# EasyEDA Pro project SCH.epro

# Schematic Schematic1_1

## Sheets
1 P1: Board Name: Board1_1; Create Date: 2026-05-31; Page Name: P1; Project Name: Clockie+1; Schematic Name: Schematic1_1; Update Date: 2026-05-31; Company: EasyEDA.com; Page Size: A4; Version: V1.0
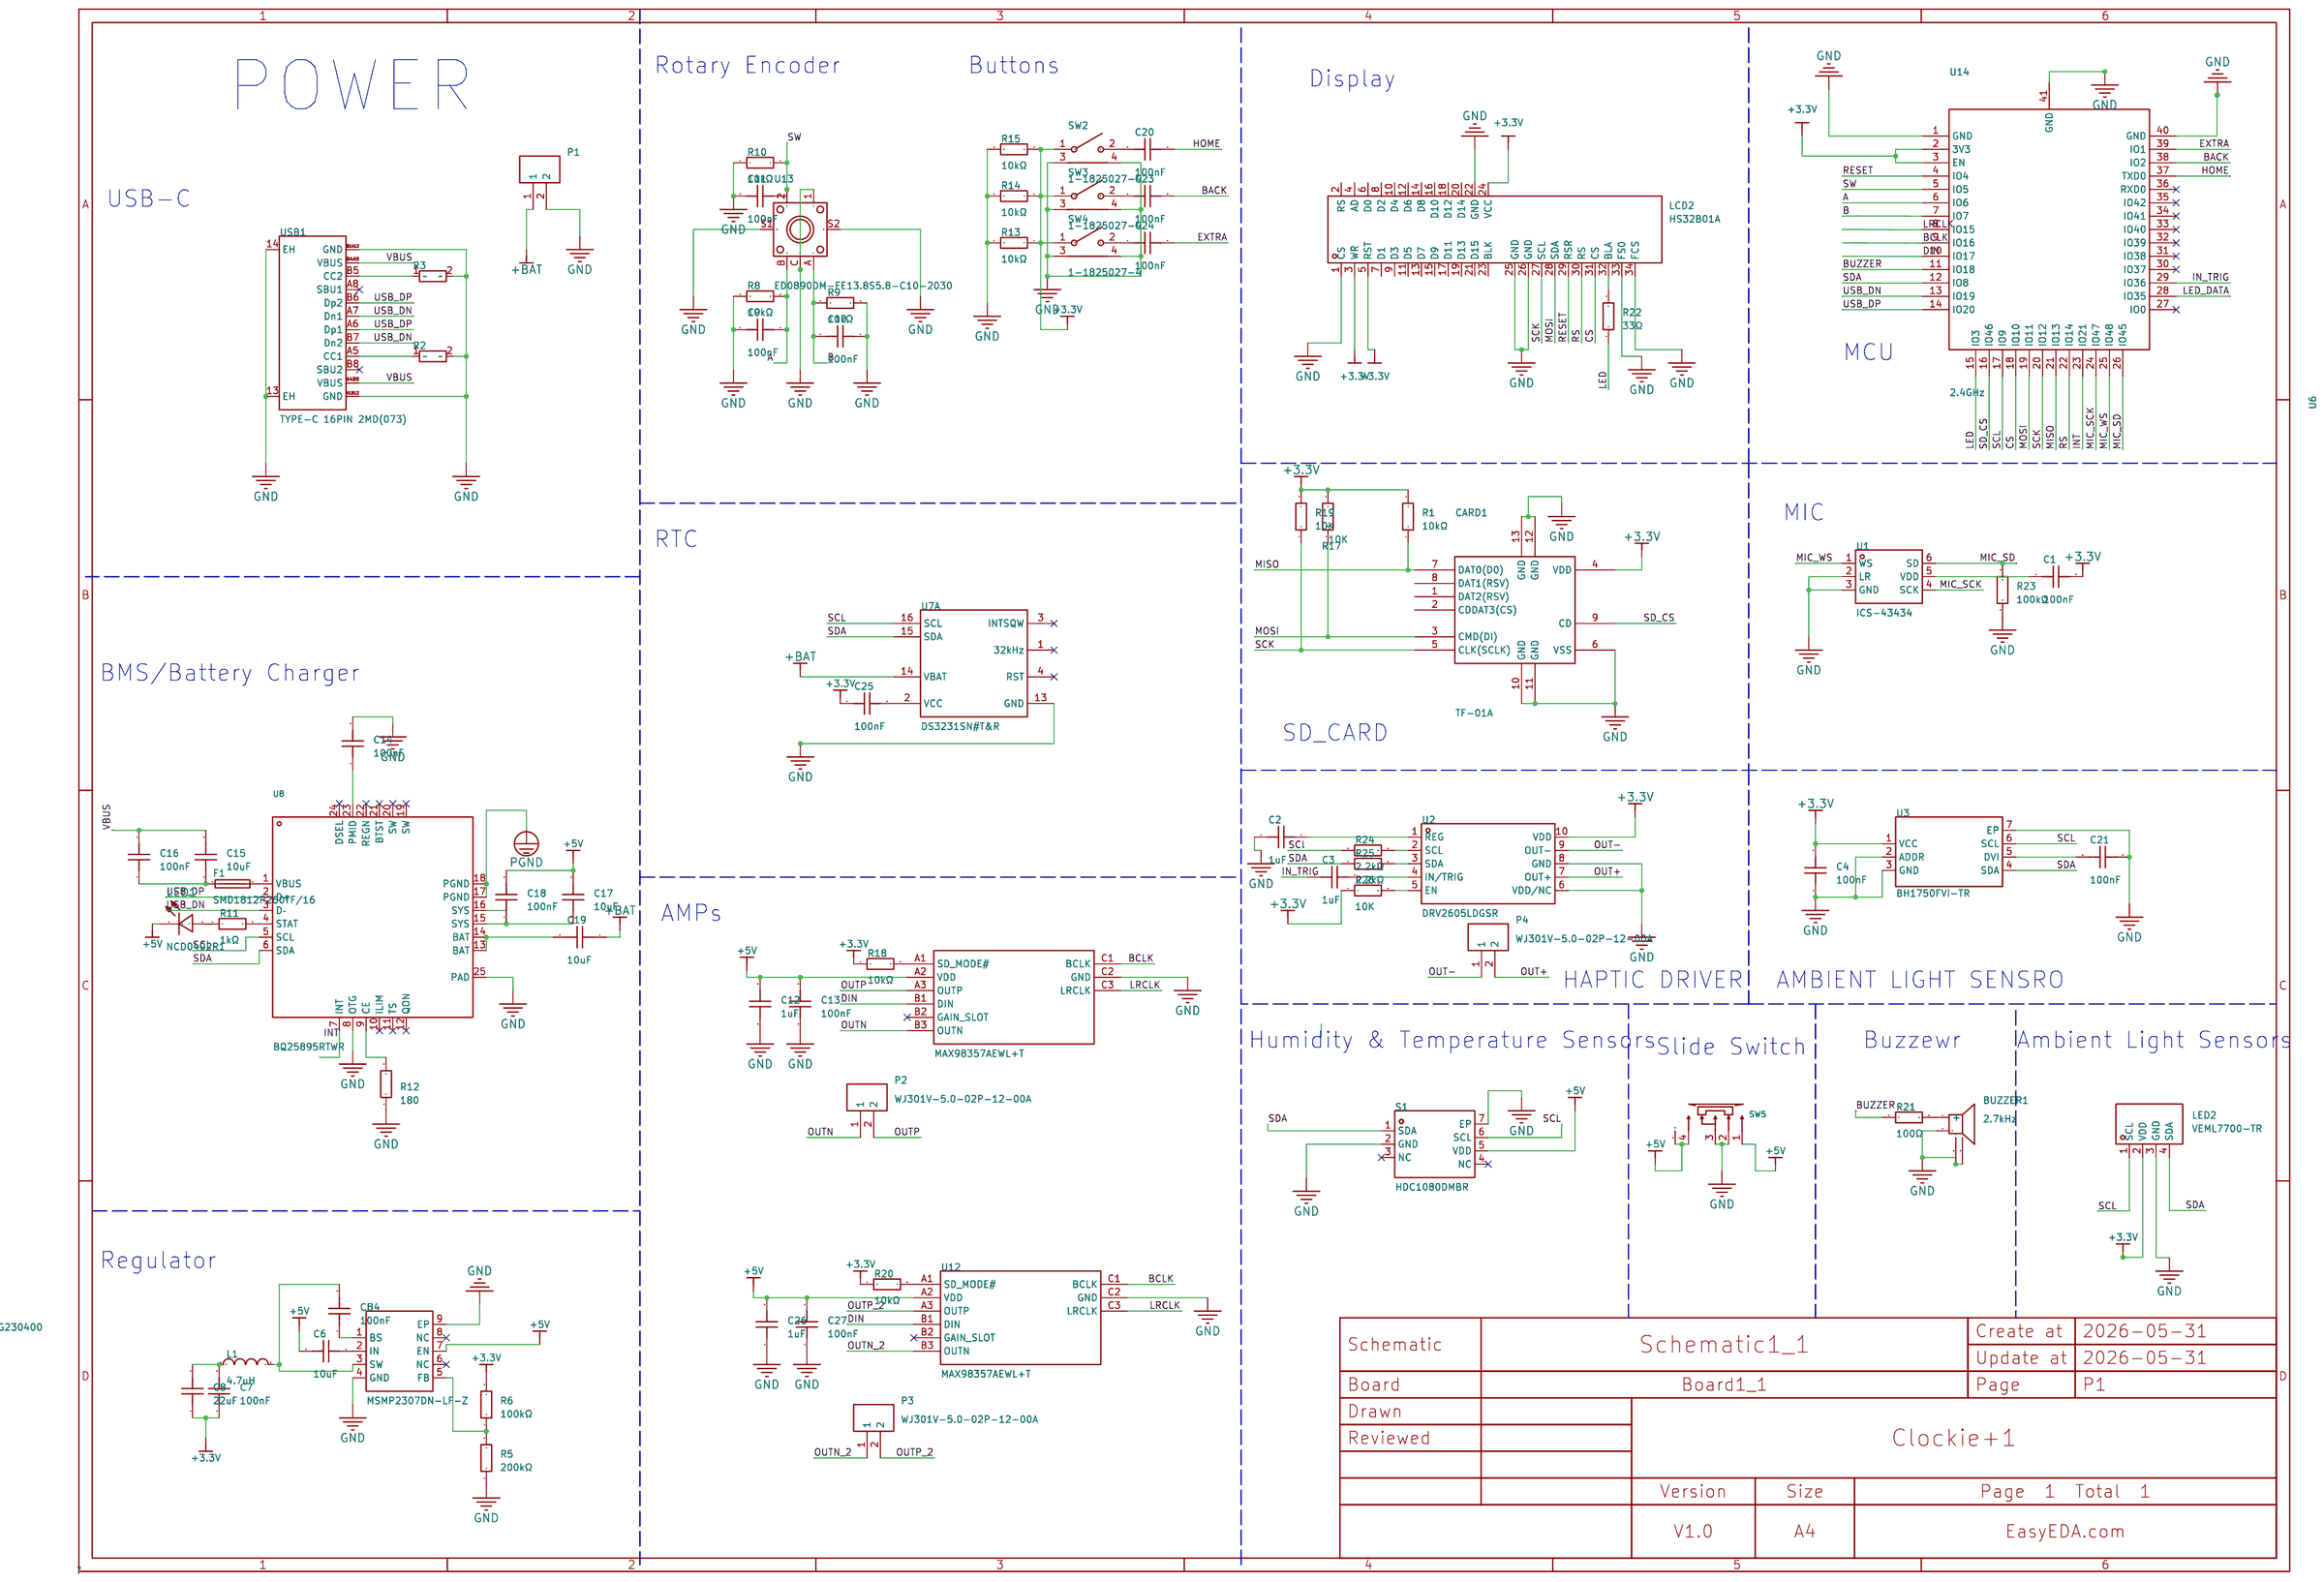
[diagram p0: P1]
2 LED: Create Date: 2026-06-07; Page Name: P2; Update Date: 2026-06-07
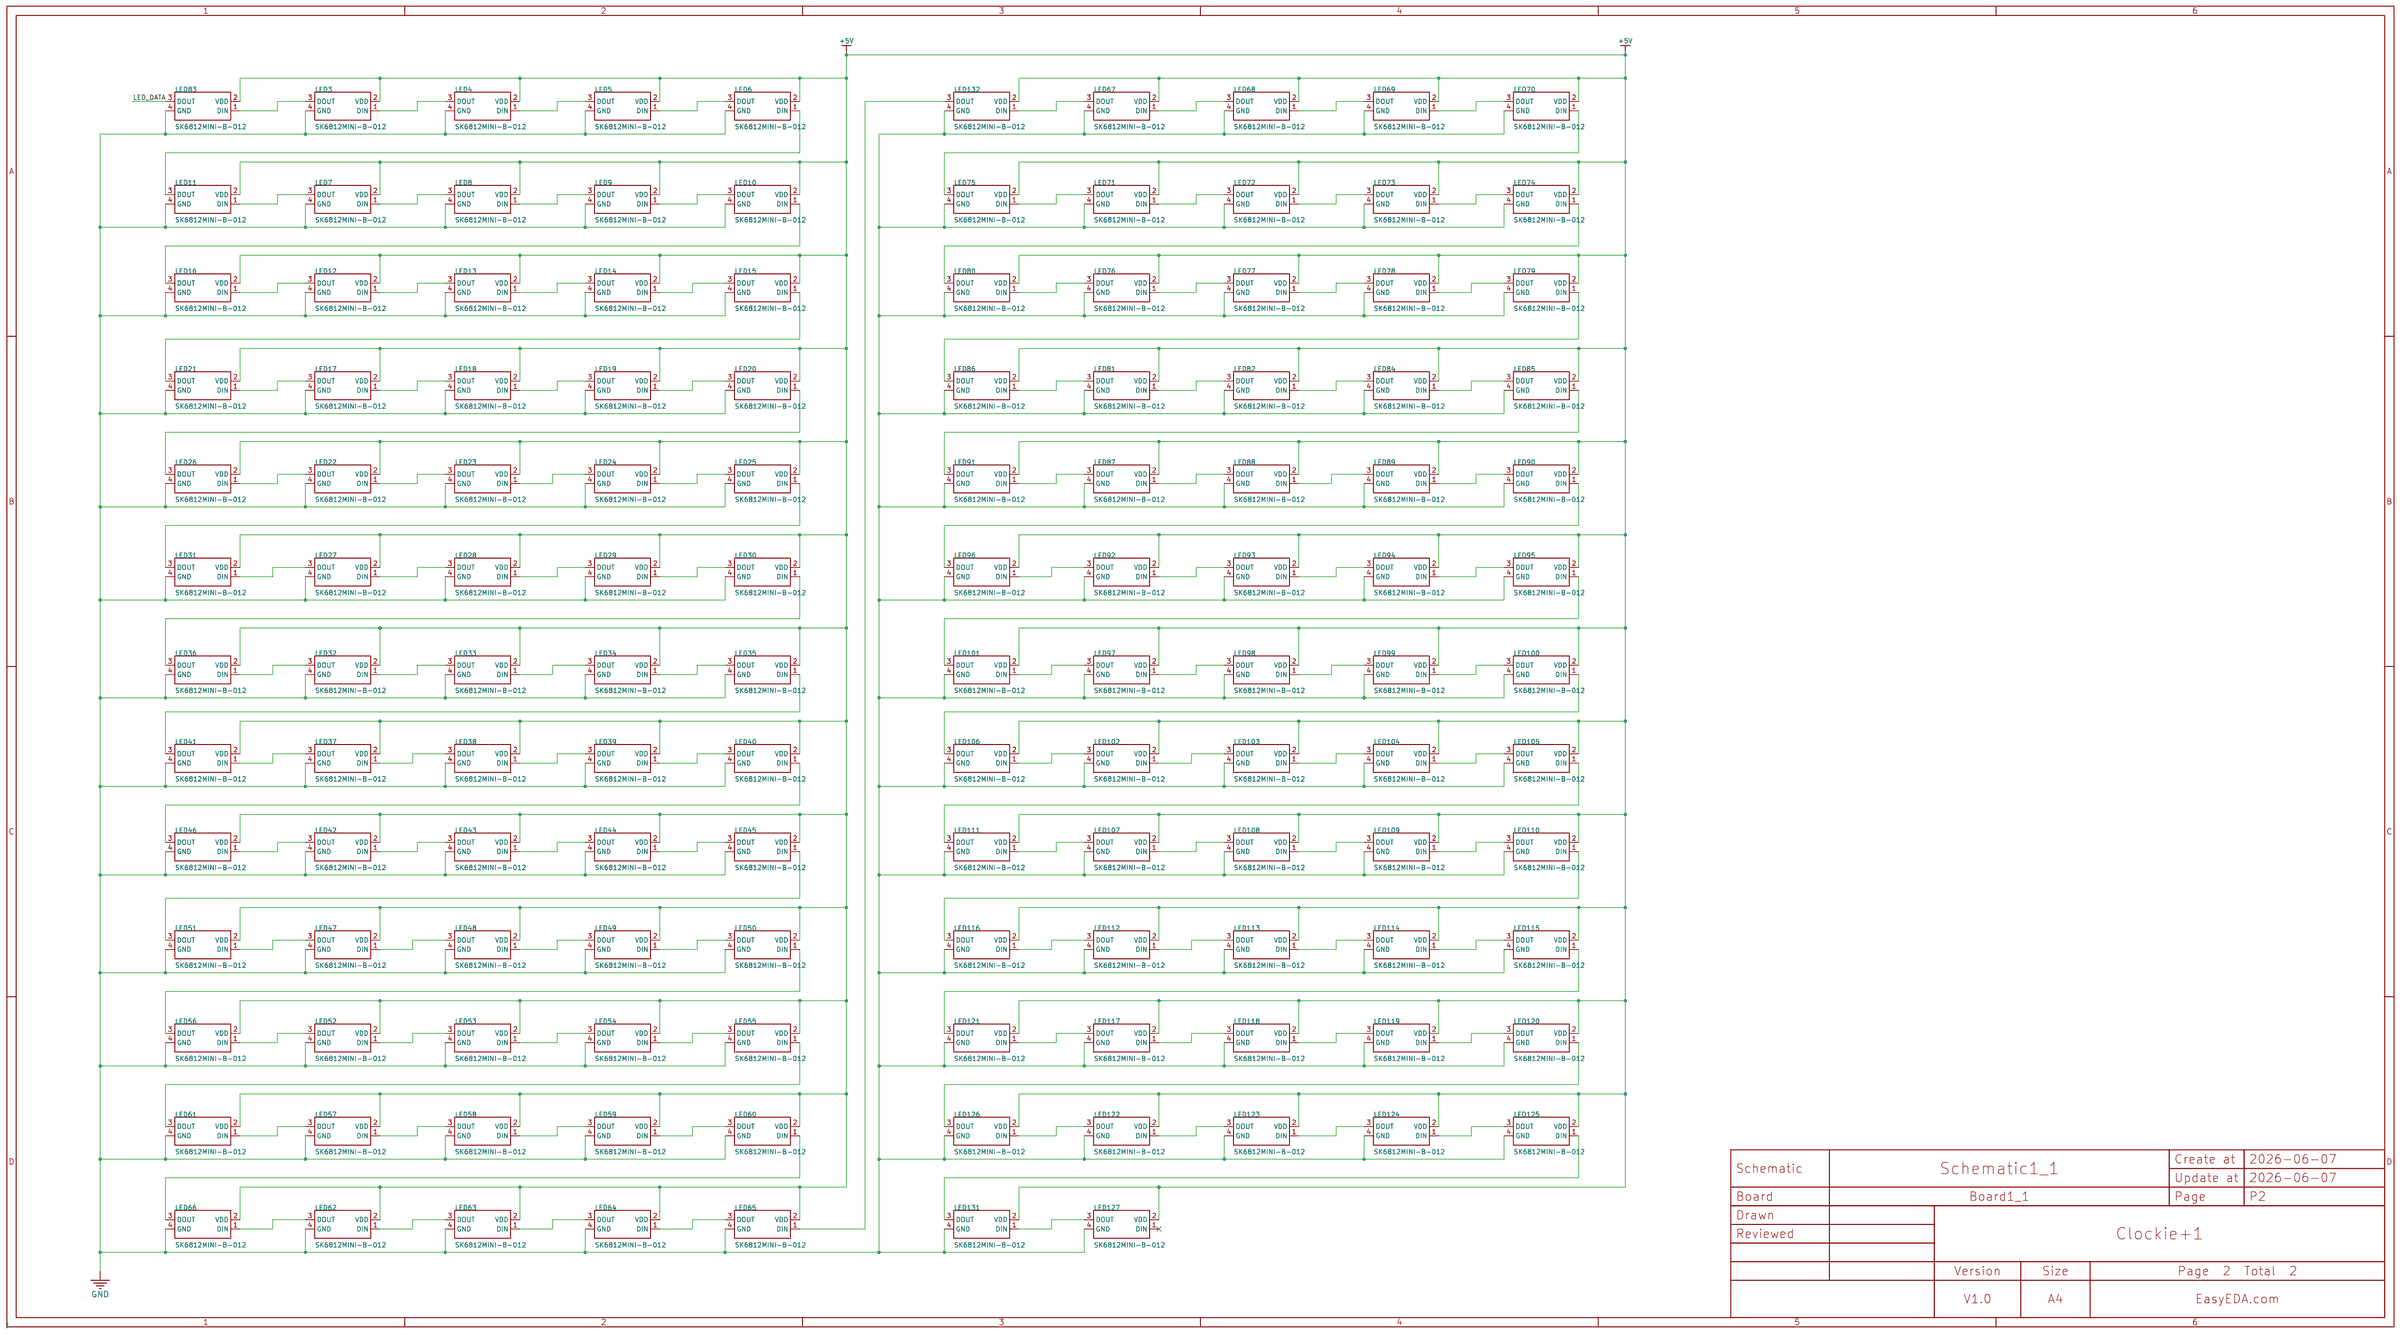
[diagram p1: LED]

## Parts
sheet LED
LED3  SK6812MINI-B-012  [LED-SMD_4P-L3.5-W3.5-R-SK6812MINI]
LED4  SK6812MINI-B-012  [LED-SMD_4P-L3.5-W3.5-R-SK6812MINI]
LED5  SK6812MINI-B-012  [LED-SMD_4P-L3.5-W3.5-R-SK6812MINI]
LED6  SK6812MINI-B-012  [LED-SMD_4P-L3.5-W3.5-R-SK6812MINI]
LED7  SK6812MINI-B-012  [LED-SMD_4P-L3.5-W3.5-R-SK6812MINI]
LED8  SK6812MINI-B-012  [LED-SMD_4P-L3.5-W3.5-R-SK6812MINI]
LED9  SK6812MINI-B-012  [LED-SMD_4P-L3.5-W3.5-R-SK6812MINI]
LED10  SK6812MINI-B-012  [LED-SMD_4P-L3.5-W3.5-R-SK6812MINI]
LED11  SK6812MINI-B-012  [LED-SMD_4P-L3.5-W3.5-R-SK6812MINI]
LED12  SK6812MINI-B-012  [LED-SMD_4P-L3.5-W3.5-R-SK6812MINI]
LED13  SK6812MINI-B-012  [LED-SMD_4P-L3.5-W3.5-R-SK6812MINI]
LED14  SK6812MINI-B-012  [LED-SMD_4P-L3.5-W3.5-R-SK6812MINI]
LED15  SK6812MINI-B-012  [LED-SMD_4P-L3.5-W3.5-R-SK6812MINI]
LED16  SK6812MINI-B-012  [LED-SMD_4P-L3.5-W3.5-R-SK6812MINI]
LED17  SK6812MINI-B-012  [LED-SMD_4P-L3.5-W3.5-R-SK6812MINI]
LED18  SK6812MINI-B-012  [LED-SMD_4P-L3.5-W3.5-R-SK6812MINI]
LED19  SK6812MINI-B-012  [LED-SMD_4P-L3.5-W3.5-R-SK6812MINI]
LED20  SK6812MINI-B-012  [LED-SMD_4P-L3.5-W3.5-R-SK6812MINI]
LED21  SK6812MINI-B-012  [LED-SMD_4P-L3.5-W3.5-R-SK6812MINI]
LED22  SK6812MINI-B-012  [LED-SMD_4P-L3.5-W3.5-R-SK6812MINI]
LED23  SK6812MINI-B-012  [LED-SMD_4P-L3.5-W3.5-R-SK6812MINI]
LED24  SK6812MINI-B-012  [LED-SMD_4P-L3.5-W3.5-R-SK6812MINI]
LED25  SK6812MINI-B-012  [LED-SMD_4P-L3.5-W3.5-R-SK6812MINI]
LED26  SK6812MINI-B-012  [LED-SMD_4P-L3.5-W3.5-R-SK6812MINI]
LED27  SK6812MINI-B-012  [LED-SMD_4P-L3.5-W3.5-R-SK6812MINI]
LED28  SK6812MINI-B-012  [LED-SMD_4P-L3.5-W3.5-R-SK6812MINI]
LED29  SK6812MINI-B-012  [LED-SMD_4P-L3.5-W3.5-R-SK6812MINI]
LED30  SK6812MINI-B-012  [LED-SMD_4P-L3.5-W3.5-R-SK6812MINI]
LED31  SK6812MINI-B-012  [LED-SMD_4P-L3.5-W3.5-R-SK6812MINI]
LED32  SK6812MINI-B-012  [LED-SMD_4P-L3.5-W3.5-R-SK6812MINI]
LED33  SK6812MINI-B-012  [LED-SMD_4P-L3.5-W3.5-R-SK6812MINI]
LED34  SK6812MINI-B-012  [LED-SMD_4P-L3.5-W3.5-R-SK6812MINI]
LED35  SK6812MINI-B-012  [LED-SMD_4P-L3.5-W3.5-R-SK6812MINI]
LED36  SK6812MINI-B-012  [LED-SMD_4P-L3.5-W3.5-R-SK6812MINI]
LED37  SK6812MINI-B-012  [LED-SMD_4P-L3.5-W3.5-R-SK6812MINI]
LED38  SK6812MINI-B-012  [LED-SMD_4P-L3.5-W3.5-R-SK6812MINI]
LED39  SK6812MINI-B-012  [LED-SMD_4P-L3.5-W3.5-R-SK6812MINI]
LED40  SK6812MINI-B-012  [LED-SMD_4P-L3.5-W3.5-R-SK6812MINI]
LED41  SK6812MINI-B-012  [LED-SMD_4P-L3.5-W3.5-R-SK6812MINI]
LED42  SK6812MINI-B-012  [LED-SMD_4P-L3.5-W3.5-R-SK6812MINI]
LED43  SK6812MINI-B-012  [LED-SMD_4P-L3.5-W3.5-R-SK6812MINI]
LED44  SK6812MINI-B-012  [LED-SMD_4P-L3.5-W3.5-R-SK6812MINI]
LED45  SK6812MINI-B-012  [LED-SMD_4P-L3.5-W3.5-R-SK6812MINI]
LED46  SK6812MINI-B-012  [LED-SMD_4P-L3.5-W3.5-R-SK6812MINI]
LED47  SK6812MINI-B-012  [LED-SMD_4P-L3.5-W3.5-R-SK6812MINI]
LED48  SK6812MINI-B-012  [LED-SMD_4P-L3.5-W3.5-R-SK6812MINI]
LED49  SK6812MINI-B-012  [LED-SMD_4P-L3.5-W3.5-R-SK6812MINI]
LED50  SK6812MINI-B-012  [LED-SMD_4P-L3.5-W3.5-R-SK6812MINI]
LED51  SK6812MINI-B-012  [LED-SMD_4P-L3.5-W3.5-R-SK6812MINI]
LED52  SK6812MINI-B-012  [LED-SMD_4P-L3.5-W3.5-R-SK6812MINI]
LED53  SK6812MINI-B-012  [LED-SMD_4P-L3.5-W3.5-R-SK6812MINI]
LED54  SK6812MINI-B-012  [LED-SMD_4P-L3.5-W3.5-R-SK6812MINI]
LED55  SK6812MINI-B-012  [LED-SMD_4P-L3.5-W3.5-R-SK6812MINI]
LED56  SK6812MINI-B-012  [LED-SMD_4P-L3.5-W3.5-R-SK6812MINI]
LED57  SK6812MINI-B-012  [LED-SMD_4P-L3.5-W3.5-R-SK6812MINI]
LED58  SK6812MINI-B-012  [LED-SMD_4P-L3.5-W3.5-R-SK6812MINI]
LED59  SK6812MINI-B-012  [LED-SMD_4P-L3.5-W3.5-R-SK6812MINI]
LED60  SK6812MINI-B-012  [LED-SMD_4P-L3.5-W3.5-R-SK6812MINI]
LED61  SK6812MINI-B-012  [LED-SMD_4P-L3.5-W3.5-R-SK6812MINI]
LED62  SK6812MINI-B-012  [LED-SMD_4P-L3.5-W3.5-R-SK6812MINI]
LED63  SK6812MINI-B-012  [LED-SMD_4P-L3.5-W3.5-R-SK6812MINI]
LED64  SK6812MINI-B-012  [LED-SMD_4P-L3.5-W3.5-R-SK6812MINI]
LED65  SK6812MINI-B-012  [LED-SMD_4P-L3.5-W3.5-R-SK6812MINI]
LED66  SK6812MINI-B-012  [LED-SMD_4P-L3.5-W3.5-R-SK6812MINI]
LED67  SK6812MINI-B-012  [LED-SMD_4P-L3.5-W3.5-R-SK6812MINI]
LED68  SK6812MINI-B-012  [LED-SMD_4P-L3.5-W3.5-R-SK6812MINI]
LED69  SK6812MINI-B-012  [LED-SMD_4P-L3.5-W3.5-R-SK6812MINI]
LED70  SK6812MINI-B-012  [LED-SMD_4P-L3.5-W3.5-R-SK6812MINI]
LED71  SK6812MINI-B-012  [LED-SMD_4P-L3.5-W3.5-R-SK6812MINI]
LED72  SK6812MINI-B-012  [LED-SMD_4P-L3.5-W3.5-R-SK6812MINI]
LED73  SK6812MINI-B-012  [LED-SMD_4P-L3.5-W3.5-R-SK6812MINI]
LED74  SK6812MINI-B-012  [LED-SMD_4P-L3.5-W3.5-R-SK6812MINI]
LED75  SK6812MINI-B-012  [LED-SMD_4P-L3.5-W3.5-R-SK6812MINI]
LED76  SK6812MINI-B-012  [LED-SMD_4P-L3.5-W3.5-R-SK6812MINI]
LED77  SK6812MINI-B-012  [LED-SMD_4P-L3.5-W3.5-R-SK6812MINI]
LED78  SK6812MINI-B-012  [LED-SMD_4P-L3.5-W3.5-R-SK6812MINI]
LED79  SK6812MINI-B-012  [LED-SMD_4P-L3.5-W3.5-R-SK6812MINI]
LED80  SK6812MINI-B-012  [LED-SMD_4P-L3.5-W3.5-R-SK6812MINI]
LED81  SK6812MINI-B-012  [LED-SMD_4P-L3.5-W3.5-R-SK6812MINI]
LED82  SK6812MINI-B-012  [LED-SMD_4P-L3.5-W3.5-R-SK6812MINI]
LED83  SK6812MINI-B-012  [LED-SMD_4P-L3.5-W3.5-R-SK6812MINI]
LED84  SK6812MINI-B-012  [LED-SMD_4P-L3.5-W3.5-R-SK6812MINI]
LED85  SK6812MINI-B-012  [LED-SMD_4P-L3.5-W3.5-R-SK6812MINI]
LED86  SK6812MINI-B-012  [LED-SMD_4P-L3.5-W3.5-R-SK6812MINI]
LED87  SK6812MINI-B-012  [LED-SMD_4P-L3.5-W3.5-R-SK6812MINI]
LED88  SK6812MINI-B-012  [LED-SMD_4P-L3.5-W3.5-R-SK6812MINI]
LED89  SK6812MINI-B-012  [LED-SMD_4P-L3.5-W3.5-R-SK6812MINI]
LED90  SK6812MINI-B-012  [LED-SMD_4P-L3.5-W3.5-R-SK6812MINI]
LED91  SK6812MINI-B-012  [LED-SMD_4P-L3.5-W3.5-R-SK6812MINI]
LED92  SK6812MINI-B-012  [LED-SMD_4P-L3.5-W3.5-R-SK6812MINI]
LED93  SK6812MINI-B-012  [LED-SMD_4P-L3.5-W3.5-R-SK6812MINI]
LED94  SK6812MINI-B-012  [LED-SMD_4P-L3.5-W3.5-R-SK6812MINI]
LED95  SK6812MINI-B-012  [LED-SMD_4P-L3.5-W3.5-R-SK6812MINI]
LED96  SK6812MINI-B-012  [LED-SMD_4P-L3.5-W3.5-R-SK6812MINI]
LED97  SK6812MINI-B-012  [LED-SMD_4P-L3.5-W3.5-R-SK6812MINI]
LED98  SK6812MINI-B-012  [LED-SMD_4P-L3.5-W3.5-R-SK6812MINI]
LED99  SK6812MINI-B-012  [LED-SMD_4P-L3.5-W3.5-R-SK6812MINI]
LED100  SK6812MINI-B-012  [LED-SMD_4P-L3.5-W3.5-R-SK6812MINI]
LED101  SK6812MINI-B-012  [LED-SMD_4P-L3.5-W3.5-R-SK6812MINI]
LED102  SK6812MINI-B-012  [LED-SMD_4P-L3.5-W3.5-R-SK6812MINI]
LED103  SK6812MINI-B-012  [LED-SMD_4P-L3.5-W3.5-R-SK6812MINI]
LED104  SK6812MINI-B-012  [LED-SMD_4P-L3.5-W3.5-R-SK6812MINI]
LED105  SK6812MINI-B-012  [LED-SMD_4P-L3.5-W3.5-R-SK6812MINI]
LED106  SK6812MINI-B-012  [LED-SMD_4P-L3.5-W3.5-R-SK6812MINI]
LED107  SK6812MINI-B-012  [LED-SMD_4P-L3.5-W3.5-R-SK6812MINI]
LED108  SK6812MINI-B-012  [LED-SMD_4P-L3.5-W3.5-R-SK6812MINI]
LED109  SK6812MINI-B-012  [LED-SMD_4P-L3.5-W3.5-R-SK6812MINI]
LED110  SK6812MINI-B-012  [LED-SMD_4P-L3.5-W3.5-R-SK6812MINI]
LED111  SK6812MINI-B-012  [LED-SMD_4P-L3.5-W3.5-R-SK6812MINI]
LED112  SK6812MINI-B-012  [LED-SMD_4P-L3.5-W3.5-R-SK6812MINI]
LED113  SK6812MINI-B-012  [LED-SMD_4P-L3.5-W3.5-R-SK6812MINI]
LED114  SK6812MINI-B-012  [LED-SMD_4P-L3.5-W3.5-R-SK6812MINI]
LED115  SK6812MINI-B-012  [LED-SMD_4P-L3.5-W3.5-R-SK6812MINI]
LED116  SK6812MINI-B-012  [LED-SMD_4P-L3.5-W3.5-R-SK6812MINI]
LED117  SK6812MINI-B-012  [LED-SMD_4P-L3.5-W3.5-R-SK6812MINI]
LED118  SK6812MINI-B-012  [LED-SMD_4P-L3.5-W3.5-R-SK6812MINI]
LED119  SK6812MINI-B-012  [LED-SMD_4P-L3.5-W3.5-R-SK6812MINI]
LED120  SK6812MINI-B-012  [LED-SMD_4P-L3.5-W3.5-R-SK6812MINI]
LED121  SK6812MINI-B-012  [LED-SMD_4P-L3.5-W3.5-R-SK6812MINI]
LED122  SK6812MINI-B-012  [LED-SMD_4P-L3.5-W3.5-R-SK6812MINI]
LED123  SK6812MINI-B-012  [LED-SMD_4P-L3.5-W3.5-R-SK6812MINI]
LED124  SK6812MINI-B-012  [LED-SMD_4P-L3.5-W3.5-R-SK6812MINI]
LED125  SK6812MINI-B-012  [LED-SMD_4P-L3.5-W3.5-R-SK6812MINI]
LED126  SK6812MINI-B-012  [LED-SMD_4P-L3.5-W3.5-R-SK6812MINI]
LED127  SK6812MINI-B-012  [LED-SMD_4P-L3.5-W3.5-R-SK6812MINI]
LED131  SK6812MINI-B-012  [LED-SMD_4P-L3.5-W3.5-R-SK6812MINI]
LED132  SK6812MINI-B-012  [LED-SMD_4P-L3.5-W3.5-R-SK6812MINI]
sheet P1
BUZZER1  2.7kHz  [BUZ-SMD_4P-L8.5-W8.5-P8.50-BR]
C1  100nF  [C0603]
C2  1uF  [C0603]
C3  1uF  [C0603]
C4  100nF  [C0603]
C5  100nF  [C0603]
C6  10uF  [C0603]
C7  100nF  [C0603]
C8  22uF  [C0603]
C9  100nF  [C0603]
C10  100nF  [C0603]
C11  100nF  [C0603]
C12  1uF  [C0603]
C13  100nF  [C0603]
C14  100nF  [C0603]
C15  10uF  [C0603]
C16  100nF  [C0603]
C17  10uF  [C0603]
C18  100nF  [C0603]
C19  10uF  [C0603]
C20  100nF  [C0603]
C21  100nF  [C0603]
C23  100nF  [C0603]
C24  100nF  [C0603]
C25  100nF  [C0603]
C26  1uF  [C0603]
C27  100nF  [C0603]
CARD1  TF-01A  [TF-SMD_TF-01A]
F1  SMD1812P260TF/16  [F1812]
L1  4.7uH  [IND-SMD_L5.0-W5.0]
LCD2  HS32B01A  [LCD-TH_L89.4-W56.0_HS32B01A]
LED1  NCD0402R1  [LED-SMD_L1.0-W0.5_FC-F1005UGK]
LED2  VEML7700-TR  [LED-SMD_4P-L6.8-W2.4_VEML7700-TR]
P1  WJ301V-5.0-02P-12-00A  [CONN-TH_2P-P5.00_WJ301V-5.00-2P]
P2  WJ301V-5.0-02P-12-00A  [CONN-TH_2P-P5.00_WJ301V-5.00-2P]
P3  WJ301V-5.0-02P-12-00A  [CONN-TH_2P-P5.00_WJ301V-5.00-2P]
P4  WJ301V-5.0-02P-12-00A  [CONN-TH_2P-P5.00_WJ301V-5.00-2P]
R1  10kΩ  [R0603]
R2  5.1kΩ  [R0603]
R3  5.1kΩ  [R0603]
R5  200kΩ  [R0603]
R6  100kΩ  [R0603]
R8  10kΩ  [R0603]
R9  10kΩ  [R0603]
R10  10kΩ  [R0603]
R11  1kΩ  [R0603]
R12  180  [R0603]
R13  10kΩ  [R0603]
R14  10kΩ  [R0603]
R15  10kΩ  [R0603]
R17  10K  [R0603]
R18  10kΩ  [R0603]
R19  10K  [R0603]
R20  10kΩ  [R0603]
R21  100Ω  [R1206]
R22  33Ω  [R0402]
R23  100kΩ  [R0603]
R24  2.2kΩ  [R0603]
R25  2.2kΩ  [R0603]
R26  10K  [R0603]
S1  HDC1080DMBR  [SENSOR-SMD_HDC1080DMBR]
SW2  1-1825027-4  [SW-TH_1-1825027-4]
SW3  1-1825027-4  [SW-TH_1-1825027-4]
SW4  1-1825027-4  [SW-TH_1-1825027-4]
SW5  SSAG230400  [SW-SMD_SSAG230400]
U1  ICS-43434  [MIC-SMD_6P-L3.5-W2.7-P0.90-BL]
U2  DRV2605LDGSR  [VSSOP-10_L3.0-W3.0-P0.50-LS4.9-BL]
U3  BH1750FVI-TR  [WSOF-6_L2.6-W1.6-P0.50-TL-EP]
U4  MSMP2307DN-LF-Z  [ESOP-8_L4.9-W3.9-P1.27-LS6.0-BL-EP]
U6  MAX98357AEWL+T  [WLP-9_L1.4-W1.3-P0.40-R3-C3-BR]
U7  DS3231SN#T&R  [SOIC-16_L10.3-W7.5-P1.27-LS10.3-BL]  (section 1)
U8  BQ25895RTWR  [QFN-24_L4.0-W4.0-P0.50-TL-EP2.7]
U12  MAX98357AEWL+T  [WLP-9_L1.4-W1.3-P0.40-R3-C3-BR]
U13  ED0890DM-FE13.8S5.8-C10-2030  [SW-TH_CTR_ED0890DM-FE13.8S5.8-C10-2030]
U14  2.4GHz  [WIRELM-SMD_ESP32-S3-WROOM-1U]
USB1  TYPE-C 16PIN 2MD(073)  [USB-C-SMD_TYPE-C-16PIN-2MD-073]

## Library data of the parts
LED3-LED127 LED131 LED132 = SK6812MINI-B-012: Wavelength:R:620nm~625nm；B:460nm~470nm；G:520nm~530nm Luminous Intensity:B:160mcd~320mcd；G:815mcd~1275mcd；R:240mcd~450mcd Fixed-Frequency Pwm Mode:1kHz Data Transmission Rate:800Kbit/s Voltage - Supply:4.5V~5.5V Voltage - Supply:4.5V~5.5V Quiescent Current; LCSC Part Name: 智能外控表面贴装SMD型LED; Supplier Part: C5183448; Manufacturer: 欧思科光电; Supplier Footprint: SMD3535-4P; JLCPCB Part Class: Extended Part; Datasheet: https://item.szlcsc.com/datasheet/SK6812MINI-B-012/5846109.html; Supplier: LCSC; Wavelength: R:620nm~625nm；B:460nm~470nm；G:520nm~530nm; Luminous Intensity: B:160mcd~320mcd；G:815mcd~1275mcd；R:240mcd~450mcd; Fixed-Frequency Pwm Mode: 1kHz; Data Transmission Rate: 800Kbit/s; Voltage - Supply: 4.5V~5.5V; Quiescent Current: 0.5mA; ESD Withstand Voltage: 2000V; Operating Temperature: -40℃~+85℃; Viewing Angle: 120°; Length: 3.5mm; Width: 1.1mm; Height: 3.7mm; Features: Built-in power-on reset circuit；Built-in power-on reset circuit
BUZZER1 = MLT-8530: Driver Circuitry:Passive (Externally Driven) Technology:Electromagnetic Voltage Rating:3.6V Voltage - Supply:2.5V~4.5V Voltage - Supply:2.5V~4.5V Frequency:2.7kHz Current Consumption:95mA Sound Pressure Level(SPL):80dB Length:8.5mm Width:8.5mm Height:3.3m; LCSC Part Name: 无源(外部驱动) 电磁式 2.7kHz; Supplier Part: C94599; Manufacturer: 华能; Supplier Footprint: SMD,8.5x8.5mm; JLCPCB Part Class: Extended Part; Datasheet: https://item.szlcsc.com/datasheet/MLT-8530/95797.html; Supplier: LCSC; Driver Circuitry: Passive (Externally Driven); Technology: Electromagnetic; Voltage Rating: 3.6V; Voltage - Supply: 2.5V~4.5V; Current Consumption: 95mA; Sound Pressure Level(SPL): 80dB; Length: 8.5mm; Width: 8.5mm; Height: 3.3mm; Operating Temperature: -20℃~+70℃; Mounting Type: SMD
C1 C4 C5 C7 C9-C11 C13 C14 C16 C18 C20 C21 C23-C25 C27 = CC0603KRX7R9BB104: Capacitance:100nF Tolerance:±10% Tolerance:±10% Voltage Rating:50V Temperature Coefficient:X7R; LCSC Part Name: 100nF ±10% 50V; Supplier Part: C14663; Manufacturer: YAGEO(国巨); Supplier Footprint: 0603; JLCPCB Part Class: Basic Part; Datasheet: https://item.szlcsc.com/datasheet/CC0603KRX7R9BB104/15331.html; Supplier: LCSC; Tolerance: ±10%; Voltage Rating: 50V; Temperature Coefficient: X7R
C2 C3 C12 C26 = CL10A105KB8NNNC: Capacitance:1uF Tolerance:±10% Tolerance:±10% Voltage Rating:50V Temperature Coefficient:X5R; LCSC Part Name: 1uF ±10% 50V; Supplier Part: C15849; Manufacturer: SAMSUNG(三星); Supplier Footprint: 0603; JLCPCB Part Class: Basic Part; Datasheet: https://item.szlcsc.com/datasheet/CL10A105KB8NNNC/16531.html; Supplier: LCSC; Tolerance: ±10%; Voltage Rating: 50V; Temperature Coefficient: X5R
C6 C15 C17 C19 = CL10A106MA8NRNC: Capacitance:10uF Tolerance:±20% Tolerance:±20% Voltage Rating:25V Temperature Coefficient:X5R; LCSC Part Name: 10uF ±20% 25V; Supplier Part: C96446; Manufacturer: SAMSUNG(三星); Supplier Footprint: 0603; JLCPCB Part Class: Basic Part; Datasheet: https://item.szlcsc.com/datasheet/CL10A106MA8NRNC/97651.html; Supplier: LCSC; Tolerance: ±20%; Voltage Rating: 25V; Temperature Coefficient: X5R
C8 = CL10A226MP8NUNE: Capacitance:22uF Tolerance:±20% Tolerance:±20% Voltage Rating:10V Temperature Coefficient:X5R; LCSC Part Name: 22uF ±20% 10V; Supplier Part: C86295; Manufacturer: SAMSUNG(三星); Supplier Footprint: 0603; JLCPCB Part Class: Extended Part; Datasheet: https://item.szlcsc.com/datasheet/CL10A226MP8NUNE/87471.html; Supplier: LCSC; Tolerance: ±20%; Voltage Rating: 10V; Temperature Coefficient: X5R
CARD1 = TF-01A_C91145: Card Connection Mode:Push-Push Card Type:MicroSD Card (TF Card) Connector Type:Connector and Ejector Additional Card Detection Pins:- Supplementary Features:With Locating Post Height Above Board:1.85mm Operating Temperature:- Operating Temperature:-; LCSC Part Name: 自弹式 MicroSD卡(TF卡) 卡座; Supplier Part: C91145; Manufacturer: 韩国韩荣; Supplier Footprint: SMD; JLCPCB Part Class: Extended Part; Datasheet: https://item.szlcsc.com/datasheet/TF-01A/92334.html; Supplier: LCSC; Card Connection Mode: Push-Push; Card Type: MicroSD Card (TF Card); Connector Type: Connector and Ejector; Supplementary Features: With Locating Post; Height Above Board: 1.85mm
F1 = SMD1812P260TF/16_C438899: Voltage - Max:16V Current - Max:100A Hold Current:2.6A Trip Current:5A Power Dissipation:1.2W Resistance - Initial (Ri) (Min):15mΩ Resistance - Post Trip (R1) (Max):50mΩ Time to Trip(Max):5s Operating Temperature:-40℃~+85℃ Operating Temperature:-40℃~+85℃; LCSC Part Name: 16V 2.6A 1812自恢复; Supplier Part: C438899; Manufacturer: PTTC(聚鼎); Supplier Footprint: 1812; JLCPCB Part Class: Extended Part; Datasheet: https://item.szlcsc.com/datasheet/SMD1812P260TF%252F16/437537.html; Supplier: LCSC; Voltage - Max: 16V; Current - Max: 100A; Hold Current: 2.6A; Trip Current: 5A; Power Dissipation: 1.2W; Resistance - Initial (Ri) (Min): 15mΩ; Resistance - Post Trip (R1) (Max): 50mΩ; Time to Trip(Max): 5s; Operating Temperature: -40℃~+85℃; Length: 4.9mm; Width: 3.5mm; Height: 2mm
L1 = CKCS5040-4.7uH/M: Inductance:4.7uH Tolerance:±20% Tolerance:±20% Current Rating:3A Current - Saturation(Isat):3.5A DC Resistance(DCR):32mΩ Type:Magnetic Shielded Inductor; LCSC Part Name: 4.7uH ±20%; Supplier Part: C354606; Manufacturer: CENKER(岑科); Supplier Footprint: SMD,5x5mm; JLCPCB Part Class: Extended Part; Datasheet: https://item.szlcsc.com/datasheet/CKCS5040-4.7uH%252FM/330231.html; Supplier: LCSC; Tolerance: ±20%; Current Rating: 3A; Current - Saturation(Isat): 3.5A; DC Resistance(DCR): 32mΩ; Type: Magnetic Shielded Inductor
LCD2 = HS32B01A: Controller Type:ST7789 Interface:SPI Size:3.2 Dot Pixels:320x240 Operating Temperature:-20℃~+70℃ Operating Temperature:-20℃~+70℃ Display Range:49.4x65.5mm Viewing Direction:12 o'clock Voltage - Supply:2.7V~3.3V Voltage - Supply:2.7V~3.3V; LCSC Part Name: 3.2’TFT 240*320(RGB); Supplier Part: C19632786; Manufacturer: HS(汉昇); JLCPCB Part Class: Extended Part; Datasheet: https://item.szlcsc.com/datasheet/HS32B01A/20932984.html; Supplier: LCSC; Controller Type: ST7789; Interface: SPI; Size: 3.2; Dot Pixels: 320x240; Operating Temperature: -20℃~+70℃; Display Range: 49.4x65.5mm; Viewing Direction: 12 o'clock; Voltage - Supply: 2.7V~3.3V
LED1 = NCD0402R1: Lamp Holder Type:- Illumination Color:Red Voltage - Forward(Vf):1.6V~2.6V Voltage - Forward(Vf):1.6V~2.6V Power(Watts):65mW Forward Current:25mA Wavelength - Dominant:615nm~635nm Wavelength - Dominant:615nm~635nm Peak Wavelength:630nm Peak Wavelength:630n; LCSC Part Name: 片式发光二极管; Supplier Part: C130719; Manufacturer: 国星光电; Supplier Footprint: 0402; JLCPCB Part Class: Extended Part; Datasheet: https://item.szlcsc.com/datasheet/NCD0402R1/142008.html; Supplier: LCSC; Illumination Color: Red; Voltage - Forward(Vf): 1.6V~2.6V; Power(Watts): 65mW; Forward Current: 25mA; Wavelength - Dominant: 615nm~635nm; Peak Wavelength: 630nm; Diode Configuration: Discrete Diode; Luminous Intensity: 30mcd; Viewing Angle: 130°; Operating Temperature: -30℃~+85℃
LED2 = VEML7700-TR: Measurement Type:Light Intensity Photoperceptivity:120klx Interface:I2C Resolution(Bits):16bit Voltage - Supply:2.5V~3.6V Voltage - Supply:2.5V~3.6V Operating Temperature:-25℃~+85℃ Operating Temperature:-25℃~+85℃ Length:6.8mm Width:2.35mm Height:3mm; LCSC Part Name: I2C接口的高精度环境光传感器; Supplier Part: C504893; Manufacturer: VISHAY(威世); Supplier Footprint: SMD-4P; JLCPCB Part Class: Extended Part; Datasheet: https://item.szlcsc.com/datasheet/VEML7700-TR/519982.html; Supplier: LCSC; Measurement Type: Light Intensity; Photoperceptivity: 120klx; Interface: I2C; Resolution(Bits): 16bit; Voltage - Supply: 2.5V~3.6V; Operating Temperature: -25℃~+85℃; Length: 6.8mm; Width: 2.35mm; Height: 3mm
P1-P4 = WJ301V-5.0-02P-12-00A: Number of Positions or Pins:1x2P Pitch:5mm Color:Blue Mounting Type:Through Hole Number of Pins:2P Number of Rows:1 Number of PINs Per Row:2 Current Rating:17.5A Voltage Rating (Max):250V Wire Gauge - AWG:14~22 Wire Gauge - mm2:1.5 Wire Gauge - mm2:1.5 Op; LCSC Part Name: 5mm 1x2P 排数:1 每排P数:2 直插; Supplier Part: C8475; Manufacturer: KANGNEX(康奈克斯电气); Supplier Footprint: 插件,P=5mm; JLCPCB Part Class: Extended Part; Datasheet: https://item.szlcsc.com/datasheet/WJ301V-5.0-02P-12-00A/8969.html; Supplier: LCSC; Number of Positions or Pins: 1x2P; Pitch: 5mm; Color: Blue; Mounting Type: Through Hole; Number of Pins: 2P; Number of Rows: 1; Number of PINs Per Row: 2; Current Rating: 17.5A; Voltage Rating (Max): 250V; Wire Gauge - AWG: 14~22; Wire Gauge - mm2: 1.5; Operating Temperature: -30℃~+120℃
R1 R13-R15 = RC0603FR-0710KL: Type:Thick Film Resistor Resistance:10kΩ Tolerance:±1% Tolerance:±1% Power(Watts):100mW Voltage-Supply(Max):75V Temperature Coefficient:±100ppm/℃ Temperature Coefficient:±100ppm/℃ Operating Temperature:-55℃~+155℃ Operating Temperature:-55℃~+155℃; LCSC Part Name: 厚膜电阻 10kΩ ±1% 100mW; Supplier Part: C98220; Manufacturer: YAGEO(国巨); Supplier Footprint: 0603; JLCPCB Part Class: Extended Part; Datasheet: https://item.szlcsc.com/datasheet/RC0603FR-0710KL/99429.html; Supplier: LCSC; Type: Thick Film Resistor; Tolerance: ±1%; Power(Watts): 100mW; Voltage-Supply(Max): 75V; Temperature Coefficient: ±100ppm/℃; Operating Temperature: -55℃~+155℃
R2 R3 = 0603WAF5101T5E: Type:Thick Film Resistor Resistance:5.1kΩ Tolerance:±1% Tolerance:±1% Power(Watts):100mW Voltage-Supply(Max):75V Temperature Coefficient:±100ppm/℃ Temperature Coefficient:±100ppm/℃ Operating Temperature:-55℃~+155℃ Operating Temperature:-55℃~+155℃; LCSC Part Name: 5.1kΩ ±1% 100mW 厚膜电阻; Supplier Part: C23186; Manufacturer: UNI-ROYAL(厚声); Supplier Footprint: 0603; JLCPCB Part Class: Basic Part; Datasheet: https://item.szlcsc.com/datasheet/0603WAF5101T5E/23913.html; Supplier: LCSC; Type: Thick Film Resistor; Tolerance: ±1%; Power(Watts): 100mW; Voltage-Supply(Max): 75V; Temperature Coefficient: ±100ppm/℃; Operating Temperature: -55℃~+155℃
R5 = 0603WAF2003T5E: Type:Thick Film Resistors Resistance:200kΩ Tolerance:±1% Tolerance:±1% Power(Watts): Overload Voltage (Max): Temperature Coefficient:±100ppm/℃ Temperature Coefficient:±100ppm/℃ Operating Temperature Range:-55℃~+155℃ Operating Temperature Range:-55℃~+155℃; LCSC Part Name: 200kΩ ±1% 100mW 厚膜电阻; Supplier Part: C25811; Manufacturer: UNI-ROYAL(厚声); Supplier Footprint: 0603; JLCPCB Part Class: Basic Part; Datasheet: https://atta.szlcsc.com/upload/public/pdf/source/20200306/C422600_1E6D84923E4A46A82E41ADD87F860B5C.pdf; Supplier: LCSC; Type: Thick Film Resistors; Tolerance: ±1%; Temperature Coefficient: ±100ppm/℃; Operating Temperature Range: -55℃~+155℃
R6 R23 = 0603WAF1003T5E: Type:Thick Film Resistor Resistance:100kΩ Tolerance:±1% Tolerance:±1% Power(Watts):100mW Voltage-Supply(Max):75V Temperature Coefficient:±100ppm/℃ Temperature Coefficient:±100ppm/℃ Operating Temperature:-55℃~+155℃ Operating Temperature:-55℃~+155℃; LCSC Part Name: 100kΩ ±1% 100mW 厚膜电阻; Supplier Part: C25803; Manufacturer: UNI-ROYAL(厚声); Supplier Footprint: 0603; JLCPCB Part Class: Basic Part; Datasheet: https://item.szlcsc.com/datasheet/0603WAF1003T5E/26546.html; Supplier: LCSC; Type: Thick Film Resistor; Tolerance: ±1%; Power(Watts): 100mW; Voltage-Supply(Max): 75V; Temperature Coefficient: ±100ppm/℃; Operating Temperature: -55℃~+155℃
R8-R10 = 0603WAF1002T5E: Type:Thick Film Resistor Resistance:10kΩ Tolerance:±1% Tolerance:±1% Power(Watts):100mW Voltage-Supply(Max):75V Temperature Coefficient:±100ppm/℃ Temperature Coefficient:±100ppm/℃ Operating Temperature:-55℃~+155℃ Operating Temperature:-55℃~+155℃; LCSC Part Name: 厚膜电阻 10kΩ ±1% 100mW; Supplier Part: C25804; Manufacturer: UNI-ROYAL(厚声); Supplier Footprint: 0603; JLCPCB Part Class: Basic Part; Datasheet: https://item.szlcsc.com/datasheet/0603WAF1002T5E/26547.html; Supplier: LCSC; Type: Thick Film Resistor; Tolerance: ±1%; Power(Watts): 100mW; Voltage-Supply(Max): 75V; Temperature Coefficient: ±100ppm/℃; Operating Temperature: -55℃~+155℃
R11 = RC0603FR-071KL: Type:Thick Film Resistor Resistance:1kΩ Tolerance:±1% Tolerance:±1% Power(Watts):100mW Voltage-Supply(Max):75V Temperature Coefficient:±100ppm/℃ Temperature Coefficient:±100ppm/℃ Operating Temperature:-55℃~+155℃ Operating Temperature:-55℃~+155℃; LCSC Part Name: 厚膜电阻 1kΩ ±1% 100mW; Supplier Part: C22548; Manufacturer: YAGEO(国巨); Supplier Footprint: 0603; JLCPCB Part Class: Extended Part; Datasheet: https://item.szlcsc.com/datasheet/RC0603FR-071KL/23274.html; Supplier: LCSC; Type: Thick Film Resistor; Tolerance: ±1%; Power(Watts): 100mW; Voltage-Supply(Max): 75V; Temperature Coefficient: ±100ppm/℃; Operating Temperature: -55℃~+155℃
R12 = Res_0603: Supplier Footprint: 0603
R17 R19 R26 = Res_0603: Supplier Footprint: 0603; LCSC Part Name: 厚膜电阻 10kΩ ±1% 100mW; Supplier Part: C98220; Manufacturer: YAGEO(国巨); Manufacturer Part: RC0603FR-0710KL; JLCPCB Part Class: Extended Part; Datasheet: https://item.szlcsc.com/datasheet/RC0603FR-0710KL/99429.html; Supplier: LCSC; Type: Thick Film Resistor; Tolerance: ±1%; Power(Watts): 100mW; Voltage-Supply(Max): 75V; Temperature Coefficient: ±100ppm/℃; Operating Temperature: -55℃~+155℃
R18 R20 = Res_0603: Type:Thick Film Resistor Resistance:10kΩ Tolerance:±1% Tolerance:±1% Power(Watts):100mW Voltage-Supply(Max):75V Temperature Coefficient:±100ppm/℃ Temperature Coefficient:±100ppm/℃ Operating Temperature:-55℃~+155℃ Operating Temperature:-55℃~+155℃; Supplier Footprint: 0603; LCSC Part Name: 厚膜电阻 10kΩ ±1% 100mW; Supplier Part: C98220; Manufacturer: YAGEO(国巨); Manufacturer Part: RC0603FR-0710KL; JLCPCB Part Class: Extended Part; Datasheet: https://item.szlcsc.com/datasheet/RC0603FR-0710KL/99429.html; Supplier: LCSC; Type: Thick Film Resistor; Tolerance: ±1%; Power(Watts): 100mW; Voltage-Supply(Max): 75V; Temperature Coefficient: ±100ppm/℃; Operating Temperature: -55℃~+155℃
R21 = CR1206F100RP05Z: Type:Thick Film Resistor Resistance:100Ω Tolerance:±1% Tolerance:±1% Power(Watts):250mW Voltage-Supply(Max):200V Temperature Coefficient:±100ppm/℃ Temperature Coefficient:±100ppm/℃ Operating Temperature:-55℃~+155℃ Operating Temperature:-55℃~+155℃; LCSC Part Name: 厚膜电阻 100Ω ±1% 250mW; Supplier Part: C245445; Manufacturer: EVER OHMS(天二科技); Supplier Footprint: 1206; JLCPCB Part Class: Extended Part; Datasheet: https://item.szlcsc.com/datasheet/CR1206F100RP05Z/243017.html; Supplier: LCSC; Type: Thick Film Resistor; Tolerance: ±1%; Power(Watts): 250mW; Voltage-Supply(Max): 200V; Temperature Coefficient: ±100ppm/℃; Operating Temperature: -55℃~+155℃
R22 = RC0402FR-0733RL: Type:Thick Film Resistor Resistance:33Ω Tolerance:±1% Tolerance:±1% Power(Watts):62.5mW Voltage-Supply(Max):50V Temperature Coefficient:±100ppm/℃ Temperature Coefficient:±100ppm/℃ Operating Temperature:-55℃~+155℃ Operating Temperature:-55℃~+155℃; LCSC Part Name: 厚膜电阻 33Ω ±1% 62.5mW; Supplier Part: C138002; Manufacturer: YAGEO(国巨); Supplier Footprint: 0402; JLCPCB Part Class: Extended Part; Datasheet: https://item.szlcsc.com/datasheet/RC0402FR-0733RL/149318.html; Supplier: LCSC; Type: Thick Film Resistor; Tolerance: ±1%; Power(Watts): 62.5mW; Voltage-Supply(Max): 50V; Temperature Coefficient: ±100ppm/℃; Operating Temperature: -55℃~+155℃
R24 R25 = 0603WAF2201T5E_C4190: Type:Thick Film Resistors Resistance:2.2kΩ Tolerance:±1% Tolerance:±1% Power(Watts): Overload Voltage (Max): Temperature Coefficient:±100ppm/℃ Temperature Coefficient:±100ppm/℃ Operating Temperature Range:-55℃~+155℃ Operating Temperature Range:-55℃~+155℃; LCSC Part Name: 2.2kΩ ±1% 100mW 厚膜电阻; Supplier Part: C4190; Manufacturer: UNI-ROYAL(厚声); Manufacturer Part: 0603WAF2201T5E; Supplier Footprint: 0603; JLCPCB Part Class: Basic Part; Datasheet: https://atta.szlcsc.com/upload/public/pdf/source/20200306/C422600_1E6D84923E4A46A82E41ADD87F860B5C.pdf; Supplier: LCSC; Type: Thick Film Resistors; Tolerance: ±1%; Temperature Coefficient: ±100ppm/℃; Operating Temperature Range: -55℃~+155℃
S1 = HDC1080DMBR: Temperature Range:-40℃~+125℃ Temperature Range:-40℃~+125℃ Humidity:0%RH~100%RH Humidity:0%RH~100%RH Interface:I2C Voltage - Supply:2.7V~5.5V Voltage - Supply:2.7V~5.5V Current - Supply:1.3uA Humidity Tolerance:±2%RH Humidity Tolerance:±2%RH Temperature To; Supplier Part: C82227; Manufacturer: TI(德州仪器); Supplier Footprint: WSON-6(3x3); JLCPCB Part Class: Extended Part; Datasheet: https://www.ti.com/cn/lit/gpn/hdc1080; Supplier: LCSC; Temperature Range: -40℃~+125℃; Humidity: 0%RH~100%RH; Interface: I2C; Voltage - Supply: 2.7V~5.5V; Current - Supply: 1.3uA; Humidity Tolerance: ±2%RH; Temperature Tolerance: ±0.2℃; Resolution: 14bit
SW2-SW4 = 1-1825027-4: Circuit:SPST Actuator Style:Round Button Operating Force:1.6N Mounting Type:Right Angle with Bracket:With Bracket Contact Current:50mA Voltage Rating:24V Termination Style:PC Pin Life:100,000 Cycles Operating Temperature:-20℃~+105℃ Operating Temperature:-; LCSC Part Name: 24V 50mA; Supplier Part: C2928195; Manufacturer: TE Connectivity(泰科电子); Supplier Footprint: 插件; JLCPCB Part Class: Extended Part; Datasheet: https://item.szlcsc.com/datasheet/1-1825027-4/3258734.html; Supplier: LCSC; Circuit: SPST; Actuator Style: Round Button; Operating Force: 1.6N; Mounting Type: Right Angle; with Bracket: With Bracket; Contact Current: 50mA; Voltage Rating: 24V; Termination Style: PC Pin; Life: 100,000 Cycles; Operating Temperature: -20℃~+105℃
SW5 = SSAG230400: Circuit:triple-pole/single-throw Actuator Style:Rectangular columnar Pin Style:SMDSplicing Switch Height:4.5mm Mounting Style:卧贴 Current Rating (DC):10mA Voltage Rating (DC):5V Current Rating (AC):- Voltage Rating (AC):- Mechanical Life:10万次 Operating Tem; Supplier Part: C255506; Manufacturer: ALPSALPINE(阿尔卑斯阿尔派); Supplier Footprint: SMD; JLCPCB Part Class: Extended Part; Datasheet: https://atta.szlcsc.com/upload/public/pdf/source/20180717/C255506_B45A99767EB193BA4FC8488F49891E74.pdf; Supplier: LCSC; Circuit: triple-pole/single-throw; Actuator Style: Rectangular columnar; Pin Style: SMDSplicing; Switch Height: 4.5mm; Mounting Style: 卧贴; Current Rating (DC): 10mA; Voltage Rating (DC): 5V; Mechanical Life: 10万次; Operating Temperature: -10℃~+60℃
U1 = ICS-43434_C5656610: Direction:Omnidirectional Voltage - Supply:1.65V~3.63V Voltage - Supply:1.65V~3.63V Current Consumption:550uA Current Consumption:550uA S/N Ratio:64dB Sensitivity:-26dB Sensitivity:-26dB Output Type:I2S Length:3.5mm Width:2.65mm Height:0.98mm Operating Te; LCSC Part Name: 1.65V~3.63V; Supplier Part: C5656610; Manufacturer: TDK InvenSense(应美盛); Supplier Footprint: LGA-6(3.5x2.7); JLCPCB Part Class: Extended Part; Datasheet: https://item.szlcsc.com/datasheet/ICS-43434/6577565.html; Supplier: LCSC; Direction: Omnidirectional; Voltage - Supply: 1.65V~3.63V; Current Consumption: 550uA; S/N Ratio: 64dB; Sensitivity: -26dB; Output Type: I2S; Length: 3.5mm; Width: 2.65mm; Height: 0.98mm; Operating Temperature: -40℃~+85℃; Features: Omnidirectional pickup
U2 = DRV2605LDGSR: Technology:Yes Number of H-bridges:1 Output Current:- Output Current:- Peak Current:- Voltage - Supply:2V~5.2V Voltage - Supply:2V~5.2V Interface:I2C RDS(on):- Quiescent Current(Iq):500uA Operating Temperature:-40℃~+85℃ Operating Temperature:-40℃~+85℃; LCSC Part Name: 5.5V电机驱动芯片; Supplier Part: C527464; Manufacturer: TI(德州仪器); Supplier Footprint: VSSOP-10-0.5mm; JLCPCB Part Class: Extended Part; Datasheet: https://www.ti.com/cn/lit/gpn/drv2605l; Supplier: LCSC; Technology: Yes; Number of H-bridges: 1; Voltage - Supply: 2V~5.2V; Interface: I2C; Quiescent Current(Iq): 500uA; Operating Temperature: -40℃~+85℃
U3 = BH1750FVI-TR: Measurement Type:Light Intensity Photoperceptivity:65.535klx Detection color:- Interface:I2C Voltage - Supply:2.4V~3.6V Voltage - Supply:2.4V~3.6V Quiescent Current:- Operating Temperature:-40℃~+85℃ Operating Temperature:-40℃~+85℃; Supplier Part: C78960; Manufacturer: ROHM(罗姆); Supplier Footprint: WSOF-6; JLCPCB Part Class: Extended Part; Datasheet: https://item.szlcsc.com/datasheet/BH1750FVI-TR/80097.html; Supplier: LCSC; Measurement Type: Light Intensity; Photoperceptivity: 65.535klx; Interface: I2C; Voltage - Supply: 2.4V~3.6V; Operating Temperature: -40℃~+85℃
U4 = MSMP2307DN-LF-Z: Supplier Part: C49375228; Manufacturer: MSKSEMI(美森科); Supplier Footprint: ESOP-8; JLCPCB Part Class: Extended Part; Datasheet: https://item.szlcsc.com/datasheet/MSMP2307DN-LF-Z/51886940.html; Supplier: LCSC
U6 U12 = MAX98357AEWL+T: Class:- Speaker Channels:Monaural；Dual Channel Output Power:- Voltage - Supply:2.5V~5.5V Voltage - Supply:2.5V~5.5V Total Harmonic Distortion + Noise (THD+N):- Quiescent Current:- Operating Temperature:-40℃~+85℃ Operating Temperature:-40℃~+85℃; LCSC Part Name: 微型、低成本、PCM 类 D 级放大器具有 AB 级性能; Supplier Part: C2682619; Manufacturer: ADI(亚德诺)/MAXIM(美信); Supplier Footprint: BGA-9(1.3x1.3); JLCPCB Part Class: Extended Part; Datasheet: https://item.szlcsc.com/datasheet/MAX98357AEWL%252BT/2777650.html; Supplier: LCSC; Speaker Channels: Monaural；Dual Channel; Voltage - Supply: 2.5V~5.5V; Operating Temperature: -40℃~+85℃
U7 = DS3231SN#T&R: Interface:I2C Voltage - Supply:2.3V~5.5V Voltage - Supply:2.3V~5.5V Operating Temperature:-40℃~+85℃ Operating Temperature:-40℃~+85℃; LCSC Part Name: 超高精度、I²C接口、集成RTC/TCXO/晶体; Supplier Part: C9866; Manufacturer: ADI(亚德诺)/MAXIM(美信); Supplier Footprint: SOIC-16-300mil; JLCPCB Part Class: Extended Part; Datasheet: https://item.szlcsc.com/datasheet/DS3231SN%2523T%2526R/10398.html; Supplier: LCSC; Interface: I2C; Voltage - Supply: 2.3V~5.5V; Operating Temperature: -40℃~+85℃
U8 = BQ25895RTWR: The Chip Type:Charging IC Voltage - Supply:3.9V~14V Voltage - Supply:3.9V~14V Charge Current - Max:5A Charging Saturation Voltage:4.608V End-Off Voltage:- Type of Battery:Lithium Battery Number of Cells:1 Number of Cells:1 Operating Temperature:-40℃~+85℃; LCSC Part Name: I²C控制单节5A快充充电器，支持高输入电压和可调电压3.1A升压操作; Supplier Part: C80200; Manufacturer: TI(德州仪器); Supplier Footprint: QFN-24-EP(4x4); JLCPCB Part Class: Extended Part; Datasheet: https://www.ti.com/cn/lit/gpn/bq25895; Supplier: LCSC; The Chip Type: Charging IC; Voltage - Supply: 3.9V~14V; Charge Current - Max: 5A; Charging Saturation Voltage: 4.608V; Type of Battery: Lithium Battery; Number of Cells: 1; Operating Temperature: -40℃~+85℃; Battery Temperature Detection: Support; 0V Battery Charge: Support; Supply Current (Iq): 12uA; Interface: I2C
U13 = ED0890DM-FE13.8S5.8-C10-2030: Encoder Type:Incremental Number of Positions (Absolute):- Number of Detents / Pulses (Incremental):20/10 Output Form:Two-phase output Whether to Press Down:- Shaft Reset:- Mounting Type:Right-Angle Current Rating (Max):1mA Rated Voltage (Max):5V Operating; LCSC Part Name: 旋转编码器; Supplier Part: C18213470; Manufacturer: CTR(长泰尔电子); Supplier Footprint: 插件; JLCPCB Part Class: Extended Part; Datasheet: https://item.szlcsc.com/datasheet/ED0890DM-FE13.8S5.8-C10-2030/19389011.html; Supplier: LCSC; Encoder Type: Incremental; Number of Detents / Pulses (Incremental): 20/10; Output Form: Two-phase output; Mounting Type: Right-Angle; Current Rating (Max): 1mA; Rated Voltage (Max): 5V; Operating Temperature: -30℃~+70℃
U14 = ESP32-S3-WROOM-1U-N16: Utilized IC / Part:ESP32-S3 Wireless Standard:Bluetooth5.0 Interface Type:I2C；GPIO；UART；SPI；USB；I2S Frequency:2.4GHz Output Power:20.5dBm Output Power:20.5dBm Voltage - Supply:3V~3.6V Voltage - Supply:3V~3.6V Receive  Current:95mA Send  Current:355mA Sens; LCSC Part Name: 不带固件 通用型Wi-Fi+低功耗蓝牙MCU模组; Supplier Part: C2980298; Manufacturer: ESPRESSIF(乐鑫); Supplier Footprint: SMD,19.2x18mm; JLCPCB Part Class: Extended Part; Datasheet: https://item.szlcsc.com/datasheet/ESP32-S3-WROOM-1U-N16/3401550.html; Supplier: LCSC; Utilized IC / Part: ESP32-S3; Wireless Standard: Bluetooth5.0; Interface Type: I2C；GPIO；UART；SPI；USB；I2S; Output Power: 20.5dBm; Voltage - Supply: 3V~3.6V; Receive  Current: 95mA; Send  Current: 355mA; Sensitivity: -103.5dBm; Operating Temperature: -40℃~+85℃
USB1 = TYPE-C 16PIN 2MD(073): Connector Type:Type-C Protocol Standard:- Gender:Female Mounting Type:Surface Mount, Right Angle Number of Contacts:16P Number of Ports:1 Current Rating-Power:3A Voltage Rating:5V Connect-Disconnect Life:10,000 Cycles Supplementary Features:- Center Heigh; LCSC Part Name: Type-C 母 卧贴; Supplier Part: C2765186; Manufacturer: SHOU HAN(首韩); Supplier Footprint: SMD; JLCPCB Part Class: Extended Part; Datasheet: https://item.szlcsc.com/datasheet/TYPE-C%252016PIN%25202MD(073)/2901843.html; Supplier: LCSC; Connector Type: Type-C; Gender: Female; Mounting Type: Surface Mount, Right Angle; Number of Contacts: 16P; Number of Ports: 1; Current Rating-Power: 3A; Voltage Rating: 5V; Connect-Disconnect Life: 10,000 Cycles; Detection color: Black; Operating Temperature: -25℃~+85℃

## Nets
+3.3V: C1.2 C4.2 C7.1 C8.1 C25.1 CARD1.4(VDD) LCD2.3(WR) LCD2.5(RST) LCD2.24(VCC) R1.2 R6.2 R13.1 R14.1 R15.1 R17.2 R18.1 R19.2 R20.1 R26.1 SW2.1 SW3.1 SW4.1 U2.10(VDD) U3.1(VCC) U14.2(3V3) U14.3(EN)
+5V: C6.2 C12.2 C13.2 C17.2 C18.2 C26.2 C27.2 LED1.1(K) LED3.2(VDD) LED4.2(VDD) LED5.2(VDD) LED6.2(VDD) LED7.2(VDD) LED8.2(VDD) LED9.2(VDD) LED10.2(VDD) LED11.2(VDD) LED12.2(VDD) LED13.2(VDD) LED14.2(VDD) LED15.2(VDD) LED16.2(VDD) LED17.2(VDD) LED18.2(VDD) LED19.2(VDD) LED20.2(VDD) LED21.2(VDD) LED22.2(VDD) LED23.2(VDD) LED24.2(VDD) LED25.2(VDD) LED26.2(VDD) LED27.2(VDD) LED28.2(VDD) LED29.2(VDD) LED30.2(VDD) LED31.2(VDD) LED32.2(VDD) LED33.2(VDD) LED34.2(VDD) LED35.2(VDD) LED36.2(VDD) LED37.2(VDD) LED38.2(VDD) LED39.2(VDD) LED40.2(VDD) LED41.2(VDD) LED42.2(VDD) LED43.2(VDD) LED44.2(VDD) LED45.2(VDD) LED46.2(VDD) LED47.2(VDD) LED48.2(VDD) LED49.2(VDD) LED50.2(VDD) LED51.2(VDD) LED52.2(VDD) LED53.2(VDD) LED54.2(VDD) LED55.2(VDD) LED56.2(VDD) LED57.2(VDD) LED58.2(VDD) LED59.2(VDD) LED60.2(VDD) LED61.2(VDD) LED62.2(VDD) LED63.2(VDD) LED64.2(VDD) LED65.2(VDD) LED66.2(VDD) LED67.2(VDD) LED68.2(VDD) LED69.2(VDD) LED70.2(VDD) LED71.2(VDD) LED72.2(VDD) LED73.2(VDD) LED74.2(VDD) LED75.2(VDD) LED76.2(VDD) LED77.2(VDD) LED78.2(VDD) LED79.2(VDD) LED80.2(VDD) LED81.2(VDD) LED82.2(VDD) LED83.2(VDD) LED84.2(VDD) LED85.2(VDD) LED86.2(VDD) LED87.2(VDD) LED88.2(VDD) LED89.2(VDD) LED90.2(VDD) LED91.2(VDD) LED92.2(VDD) LED93.2(VDD) LED94.2(VDD) LED95.2(VDD) LED96.2(VDD) LED97.2(VDD) LED98.2(VDD) LED99.2(VDD) LED100.2(VDD) LED101.2(VDD) LED102.2(VDD) LED103.2(VDD) LED104.2(VDD) LED105.2(VDD) LED106.2(VDD) LED107.2(VDD) LED108.2(VDD) LED109.2(VDD) LED110.2(VDD) LED111.2(VDD) LED112.2(VDD) LED113.2(VDD) LED114.2(VDD) LED115.2(VDD) LED116.2(VDD) LED117.2(VDD) LED118.2(VDD) LED119.2(VDD) LED120.2(VDD) LED121.2(VDD) LED122.2(VDD) LED123.2(VDD) LED124.2(VDD) LED125.2(VDD) LED126.2(VDD) LED127.2(VDD) LED131.2(VDD) LED132.2(VDD) S1.5(VDD) SW5.0 SW5.1 SW5.4 U4.7(EN) U6.A2(VDD) U12.A2(VDD)
GND: BUZZER1.2 BUZZER1.3 BUZZER1.4 C2.1 C4.1 C9.2 C10.1 C11.2 C12.1 C13.1 C14.2 C21.1 C26.1 C27.1 CARD1.6(VSS) CARD1.10(GND) CARD1.11(GND) CARD1.12(GND) CARD1.13(GND) LCD2.1(CS) LCD2.22(GND) LCD2.25(GND) LCD2.26(GND) LCD2.33(FS0) LCD2.34(FCS) LED3.4(GND) LED4.4(GND) LED5.4(GND) LED6.4(GND) LED7.4(GND) LED8.4(GND) LED9.4(GND) LED10.4(GND) LED11.4(GND) LED12.4(GND) LED13.4(GND) LED14.4(GND) LED15.4(GND) LED16.4(GND) LED17.4(GND) LED18.4(GND) LED19.4(GND) LED20.4(GND) LED21.4(GND) LED22.4(GND) LED23.4(GND) LED24.4(GND) LED25.4(GND) LED26.4(GND) LED27.4(GND) LED28.4(GND) LED29.4(GND) LED30.4(GND) LED31.4(GND) LED32.4(GND) LED33.4(GND) LED34.4(GND) LED35.4(GND) LED36.4(GND) LED37.4(GND) LED38.4(GND) LED39.4(GND) LED40.4(GND) LED41.4(GND) LED42.4(GND) LED43.4(GND) LED44.4(GND) LED45.4(GND) LED46.4(GND) LED47.4(GND) LED48.4(GND) LED49.4(GND) LED50.4(GND) LED51.4(GND) LED52.4(GND) LED53.4(GND) LED54.4(GND) LED55.4(GND) LED56.4(GND) LED57.4(GND) LED58.4(GND) LED59.4(GND) LED60.4(GND) LED61.4(GND) LED62.4(GND) LED63.4(GND) LED64.4(GND) LED65.4(GND) LED66.4(GND) LED67.4(GND) LED68.4(GND) LED69.4(GND) LED70.4(GND) LED71.4(GND) LED72.4(GND) LED73.4(GND) LED74.4(GND) LED75.4(GND) LED76.4(GND) LED77.4(GND) LED78.4(GND) LED79.4(GND) LED80.4(GND) LED81.4(GND) LED82.4(GND) LED83.4(GND) LED84.4(GND) LED85.4(GND) LED86.4(GND) LED87.4(GND) LED88.4(GND) LED89.4(GND) LED90.4(GND) LED91.4(GND) LED92.4(GND) LED93.4(GND) LED94.4(GND) LED95.4(GND) LED96.4(GND) LED97.4(GND) LED98.4(GND) LED99.4(GND) LED100.4(GND) LED101.4(GND) LED102.4(GND) LED103.4(GND) LED104.4(GND) LED105.4(GND) LED106.4(GND) LED107.4(GND) LED108.4(GND) LED109.4(GND) LED110.4(GND) LED111.4(GND) LED112.4(GND) LED113.4(GND) LED114.4(GND) LED115.4(GND) LED116.4(GND) LED117.4(GND) LED118.4(GND) LED119.4(GND) LED120.4(GND) LED121.4(GND) LED122.4(GND) LED123.4(GND) LED124.4(GND) LED125.4(GND) LED126.4(GND) LED127.4(GND) LED131.4(GND) LED132.4(GND) P1.2 R2.2 R3.2 R5.1 R8.1 R9.2 R10.1 R12.1 R13.2 R14.2 R15.2 R23.1 S1.2(GND) S1.7(EP) SW2.3 SW2.4 SW3.3 SW3.4 SW4.3 SW4.4 SW5.2 SW5.3 U1.2(LR) U1.3(GND) U2.6(VDD/NC) U2.8(GND) U3.2(ADDR) U3.3(GND) U3.7(EP) U4.4(GND) U4.9(EP) U6.C2(GND) U7.13(GND) U8.8(OTG) U8.25(PAD) U12.C2(GND) U13.1 U13.C U13.S1 U13.S2 U14.1(GND) U14.40(GND) U14.41(GND) USB1.13(EH) USB1.14(EH) USB1.A1B12(GND) USB1.B1A12(GND)
PGND: U8.17(PGND) U8.18(PGND)
VBUS: C15.2 C16.2 USB1.A4B9(VBUS) USB1.B4A9(VBUS)
+BAT: C19.1 P1.1 U7.14(VBAT)
A: C9.1 R8.2 U13.B U14.6(IO6)
B: C10.2 R9.1 U13.A U14.7(IO7)
BACK: C23.2 U14.38(IO2)
BCLK: U6.C1(BCLK) U12.C1(BCLK)
BUZZER: R21.1 U14.11(IO18)
CS: LCD2.31(CS)
DIN: U6.B1(DIN) U12.B1(DIN)
EXTRA: C24.2 U14.39(IO1)
HOME: C20.2 U14.37(TXD0)
IN_TRIG: C3.1 U14.29(IO36)
INT: U8.7(INT)
LED: R22.1
LED_DATA: LED83.3(DOUT) U14.28(IO35)
LRCLK: U6.C3(LRCLK) U12.C3(LRCLK)
MIC_SCK: U1.4(SCK) U14.24(IO47)
MIC_SD: R23.2 U1.6(SD) U14.26(IO45)
MIC_WS: U1.1(WS) U14.25(IO48)
MISO: CARD1.7(DAT0(D0)) R1.1 U14.21(IO13)
MOSI: CARD1.3(CMD(DI)) LCD2.28(SDA) R17.1
OUT+: P4.2 U2.7(OUT+)
OUT-: P4.1 U2.9(OUT-)
OUTN: P2.1 U6.B3(OUTN)
OUTN_2: P3.1 U12.B3(OUTN)
OUTP: P2.2 U6.A3(OUTP)
OUTP_2: P3.2 U12.A3(OUTP)
RESET: LCD2.29(RSR) U14.4(IO4)
RS: LCD2.30(RS)
SCK: CARD1.5(CLK(SCLK)) LCD2.27(SCL) R19.1
SCl: R24.1
SCL: S1.6(SCL) U3.6(SCL) U7.16(SCL) U8.5(SCL)
SD_CS: CARD1.9(CD) U14.16(IO46)
SDA: R25.1 S1.1(SDA) U3.4(SDA) U7.15(SDA) U8.6(SDA) U14.12(IO8)
SW: C11.1 R10.2 U13.2 U14.5(IO5)
USB_DN: U8.3(D–) U14.13(IO19) USB1.A7(Dn1) USB1.B7(Dn2)
USB_DP: U8.2(D+) U14.14(IO20) USB1.A6(Dp1) USB1.B6(Dp2)
Net-(BUZZER1-1): BUZZER1.1(+) R21.2
Net-(C1-1): C1.1 U1.5(VDD)
Net-(C2-2): C2.2 U2.1(REG)
Net-(C3-2): C3.2 U2.4(IN/TRIG)
Net-(C5-1): C5.1 U4.1(BS)
Net-(C5-2): C5.2 L1.2 U4.3(SW)
Net-(C6-1): C6.1 U4.2(IN)
Net-(C7-2): C7.2 C8.2 L1.1
Net-(C14-1): C14.1 U8.23(PMID)
Net-(C15-1): C15.1 C16.1 F1.1
Net-(C17-1): C17.1 C18.1 U8.15(SYS) U8.16(SYS)
Net-(C19-2): C19.2 U8.13(BAT) U8.14(BAT)
Net-(C20-1): C20.1 SW2.2
Net-(C21-2): C21.2 U3.5(DVI)
Net-(C23-1): C23.1 SW3.2
Net-(C24-1): C24.1 SW4.2
Net-(C25-2): C25.2 U7.2(VCC)
Net-(F1-2): F1.2 U8.1(VBUS)
Net-(LCD2-32): LCD2.32(BLA) R22.2
Net-(LED1-2): LED1.2(A) R11.1
Net-(LED3-1): LED3.1(DIN) LED4.3(DOUT)
Net-(LED3-3): LED3.3(DOUT) LED83.1(DIN)
Net-(LED4-1): LED4.1(DIN) LED5.3(DOUT)
Net-(LED5-1): LED5.1(DIN) LED6.3(DOUT)
Net-(LED6-1): LED6.1(DIN) LED11.3(DOUT)
Net-(LED7-1): LED7.1(DIN) LED8.3(DOUT)
Net-(LED7-3): LED7.3(DOUT) LED11.1(DIN)
Net-(LED8-1): LED8.1(DIN) LED9.3(DOUT)
Net-(LED9-1): LED9.1(DIN) LED10.3(DOUT)
Net-(LED10-1): LED10.1(DIN) LED16.3(DOUT)
Net-(LED12-1): LED12.1(DIN) LED13.3(DOUT)
Net-(LED12-3): LED12.3(DOUT) LED16.1(DIN)
Net-(LED13-1): LED13.1(DIN) LED14.3(DOUT)
Net-(LED14-1): LED14.1(DIN) LED15.3(DOUT)
Net-(LED15-1): LED15.1(DIN) LED21.3(DOUT)
Net-(LED17-1): LED17.1(DIN) LED18.3(DOUT)
Net-(LED17-3): LED17.3(DOUT) LED21.1(DIN)
Net-(LED18-1): LED18.1(DIN) LED19.3(DOUT)
Net-(LED19-1): LED19.1(DIN) LED20.3(DOUT)
Net-(LED20-1): LED20.1(DIN) LED26.3(DOUT)
Net-(LED22-1): LED22.1(DIN) LED23.3(DOUT)
Net-(LED22-3): LED22.3(DOUT) LED26.1(DIN)
Net-(LED23-1): LED23.1(DIN) LED24.3(DOUT)
Net-(LED24-1): LED24.1(DIN) LED25.3(DOUT)
Net-(LED25-1): LED25.1(DIN) LED31.3(DOUT)
Net-(LED27-1): LED27.1(DIN) LED28.3(DOUT)
Net-(LED27-3): LED27.3(DOUT) LED31.1(DIN)
Net-(LED28-1): LED28.1(DIN) LED29.3(DOUT)
Net-(LED29-1): LED29.1(DIN) LED30.3(DOUT)
Net-(LED30-1): LED30.1(DIN) LED36.3(DOUT)
Net-(LED32-1): LED32.1(DIN) LED33.3(DOUT)
Net-(LED32-3): LED32.3(DOUT) LED36.1(DIN)
Net-(LED33-1): LED33.1(DIN) LED34.3(DOUT)
Net-(LED34-1): LED34.1(DIN) LED35.3(DOUT)
Net-(LED35-1): LED35.1(DIN) LED41.3(DOUT)
Net-(LED37-1): LED37.1(DIN) LED38.3(DOUT)
Net-(LED37-3): LED37.3(DOUT) LED41.1(DIN)
Net-(LED38-1): LED38.1(DIN) LED39.3(DOUT)
Net-(LED39-1): LED39.1(DIN) LED40.3(DOUT)
Net-(LED40-1): LED40.1(DIN) LED46.3(DOUT)
Net-(LED42-1): LED42.1(DIN) LED43.3(DOUT)
Net-(LED42-3): LED42.3(DOUT) LED46.1(DIN)
Net-(LED43-1): LED43.1(DIN) LED44.3(DOUT)
Net-(LED44-1): LED44.1(DIN) LED45.3(DOUT)
Net-(LED45-1): LED45.1(DIN) LED51.3(DOUT)
Net-(LED47-1): LED47.1(DIN) LED48.3(DOUT)
Net-(LED47-3): LED47.3(DOUT) LED51.1(DIN)
Net-(LED48-1): LED48.1(DIN) LED49.3(DOUT)
Net-(LED49-1): LED49.1(DIN) LED50.3(DOUT)
Net-(LED50-1): LED50.1(DIN) LED56.3(DOUT)
Net-(LED52-1): LED52.1(DIN) LED53.3(DOUT)
Net-(LED52-3): LED52.3(DOUT) LED56.1(DIN)
Net-(LED53-1): LED53.1(DIN) LED54.3(DOUT)
Net-(LED54-1): LED54.1(DIN) LED55.3(DOUT)
Net-(LED55-1): LED55.1(DIN) LED61.3(DOUT)
Net-(LED57-1): LED57.1(DIN) LED58.3(DOUT)
Net-(LED57-3): LED57.3(DOUT) LED61.1(DIN)
Net-(LED58-1): LED58.1(DIN) LED59.3(DOUT)
Net-(LED59-1): LED59.1(DIN) LED60.3(DOUT)
Net-(LED60-1): LED60.1(DIN) LED66.3(DOUT)
Net-(LED62-1): LED62.1(DIN) LED63.3(DOUT)
Net-(LED62-3): LED62.3(DOUT) LED66.1(DIN)
Net-(LED63-1): LED63.1(DIN) LED64.3(DOUT)
Net-(LED64-1): LED64.1(DIN) LED65.3(DOUT)
Net-(LED65-1): LED65.1(DIN) LED132.3(DOUT)
Net-(LED67-1): LED67.1(DIN) LED68.3(DOUT)
Net-(LED67-3): LED67.3(DOUT) LED132.1(DIN)
Net-(LED68-1): LED68.1(DIN) LED69.3(DOUT)
Net-(LED69-1): LED69.1(DIN) LED70.3(DOUT)
Net-(LED70-1): LED70.1(DIN) LED75.3(DOUT)
Net-(LED71-1): LED71.1(DIN) LED72.3(DOUT)
Net-(LED71-3): LED71.3(DOUT) LED75.1(DIN)
Net-(LED72-1): LED72.1(DIN) LED73.3(DOUT)
Net-(LED73-1): LED73.1(DIN) LED74.3(DOUT)
Net-(LED74-1): LED74.1(DIN) LED80.3(DOUT)
Net-(LED76-1): LED76.1(DIN) LED77.3(DOUT)
Net-(LED76-3): LED76.3(DOUT) LED80.1(DIN)
Net-(LED77-1): LED77.1(DIN) LED78.3(DOUT)
Net-(LED78-1): LED78.1(DIN) LED79.3(DOUT)
Net-(LED79-1): LED79.1(DIN) LED86.3(DOUT)
Net-(LED81-1): LED81.1(DIN) LED82.3(DOUT)
Net-(LED81-3): LED81.3(DOUT) LED86.1(DIN)
Net-(LED82-1): LED82.1(DIN) LED84.3(DOUT)
Net-(LED84-1): LED84.1(DIN) LED85.3(DOUT)
Net-(LED85-1): LED85.1(DIN) LED91.3(DOUT)
Net-(LED87-1): LED87.1(DIN) LED88.3(DOUT)
Net-(LED87-3): LED87.3(DOUT) LED91.1(DIN)
Net-(LED88-1): LED88.1(DIN) LED89.3(DOUT)
Net-(LED89-1): LED89.1(DIN) LED90.3(DOUT)
Net-(LED90-1): LED90.1(DIN) LED96.3(DOUT)
Net-(LED92-1): LED92.1(DIN) LED93.3(DOUT)
Net-(LED92-3): LED92.3(DOUT) LED96.1(DIN)
Net-(LED93-1): LED93.1(DIN) LED94.3(DOUT)
Net-(LED94-1): LED94.1(DIN) LED95.3(DOUT)
Net-(LED95-1): LED95.1(DIN) LED101.3(DOUT)
Net-(LED97-1): LED97.1(DIN) LED98.3(DOUT)
Net-(LED97-3): LED97.3(DOUT) LED101.1(DIN)
Net-(LED98-1): LED98.1(DIN) LED99.3(DOUT)
Net-(LED99-1): LED99.1(DIN) LED100.3(DOUT)
Net-(LED100-1): LED100.1(DIN) LED106.3(DOUT)
Net-(LED102-1): LED102.1(DIN) LED103.3(DOUT)
Net-(LED102-3): LED102.3(DOUT) LED106.1(DIN)
Net-(LED103-1): LED103.1(DIN) LED104.3(DOUT)
Net-(LED104-1): LED104.1(DIN) LED105.3(DOUT)
Net-(LED105-1): LED105.1(DIN) LED111.3(DOUT)
Net-(LED107-1): LED107.1(DIN) LED108.3(DOUT)
Net-(LED107-3): LED107.3(DOUT) LED111.1(DIN)
Net-(LED108-1): LED108.1(DIN) LED109.3(DOUT)
Net-(LED109-1): LED109.1(DIN) LED110.3(DOUT)
Net-(LED110-1): LED110.1(DIN) LED116.3(DOUT)
Net-(LED112-1): LED112.1(DIN) LED113.3(DOUT)
Net-(LED112-3): LED112.3(DOUT) LED116.1(DIN)
Net-(LED113-1): LED113.1(DIN) LED114.3(DOUT)
Net-(LED114-1): LED114.1(DIN) LED115.3(DOUT)
Net-(LED115-1): LED115.1(DIN) LED121.3(DOUT)
Net-(LED117-1): LED117.1(DIN) LED118.3(DOUT)
Net-(LED117-3): LED117.3(DOUT) LED121.1(DIN)
Net-(LED118-1): LED118.1(DIN) LED119.3(DOUT)
Net-(LED119-1): LED119.1(DIN) LED120.3(DOUT)
Net-(LED120-1): LED120.1(DIN) LED126.3(DOUT)
Net-(LED122-1): LED122.1(DIN) LED123.3(DOUT)
Net-(LED122-3): LED122.3(DOUT) LED126.1(DIN)
Net-(LED123-1): LED123.1(DIN) LED124.3(DOUT)
Net-(LED124-1): LED124.1(DIN) LED125.3(DOUT)
Net-(LED125-1): LED125.1(DIN) LED131.3(DOUT)
Net-(LED127-3): LED127.3(DOUT) LED131.1(DIN)
Net-(R2-1): R2.1 USB1.A5(CC1)
Net-(R3-1): R3.1 USB1.B5(CC2)
Net-(R5-2): R5.2 R6.1 U4.5(FB)
Net-(R11-2): R11.2 U8.4(STAT)
Net-(R12-2): R12.2 U8.9(CE)
Net-(R18-2): R18.2 U6.A1(SD_MODE#)
Net-(R20-2): R20.2 U12.A1(SD_MODE#)
Net-(R24-2): R24.2 U2.2(SCL)
Net-(R25-2): R25.2 U2.3(SDA)
Net-(R26-2): R26.2 U2.5(EN)

Not connected (* = marked no-connect by the designer): CARD1 1(DAT2(RSV)) 2(CDDAT3(CS)) 8(DAT1(RSV)); LCD2 2(RS) 4(AD) 6(D0) 7(D1) 8(D2) 9(D3) 10(D4) 11(D5) 12(D6) 13(D7) 14(D8) 15(D9) 16(D10) 17(D11) 18(D12) 19(D13) 20(D14) 21(D15) 23(BLK); LED2 1(SCL) 2(VDD) 3(GND) 4(SDA); LED127 1(DIN)*; S1 3(NC)* 4(NC)*; U4 6(NC)* 8(NC)*; U6 B2(GAIN_SLOT)*; U7 1(32kHz)* 3(INTSQW)* 4(RST)*; U8 10(ILIM)* 11(TS)* 12(QON)* 19(SW)* 20(SW)* 21(BTST)* 22(REGN)* 24(DSEL)*; U12 B2(GAIN_SLOT)*; U14 8(IO15) 9(IO16) 10(IO17) 15(IO3) 17(IO9) 18(IO10) 19(IO11) 20(IO12) 22(IO14) 23(IO21) 27(IO0)* 30(IO37)* 31(IO38)* 32(IO39)* 33(IO40)* 34(IO41)* 35(IO42)* 36(RXD0)*; USB1 A8(SBU1)* B8(SBU2)*

## Notes on the sheets
sheet 1
- Rotary Encoder
- Buttons
- Display
- POWER
- USB-C
- MCU
- MIC
- RTC
- BMS/Battery Charger
- SD_CARD
- AMPs
- HAPTIC DRIVER
- AMBIENT LIGHT SENSRO
- Humidity & Temperature Sensors
- Slide Switch
- Buzzewr
- Ambient Light Sensors
- Regulator
